# Altium schematic sheet mini-inverter.SchDoc
size A4; SheetNumber: 1; SheetTotal: 5
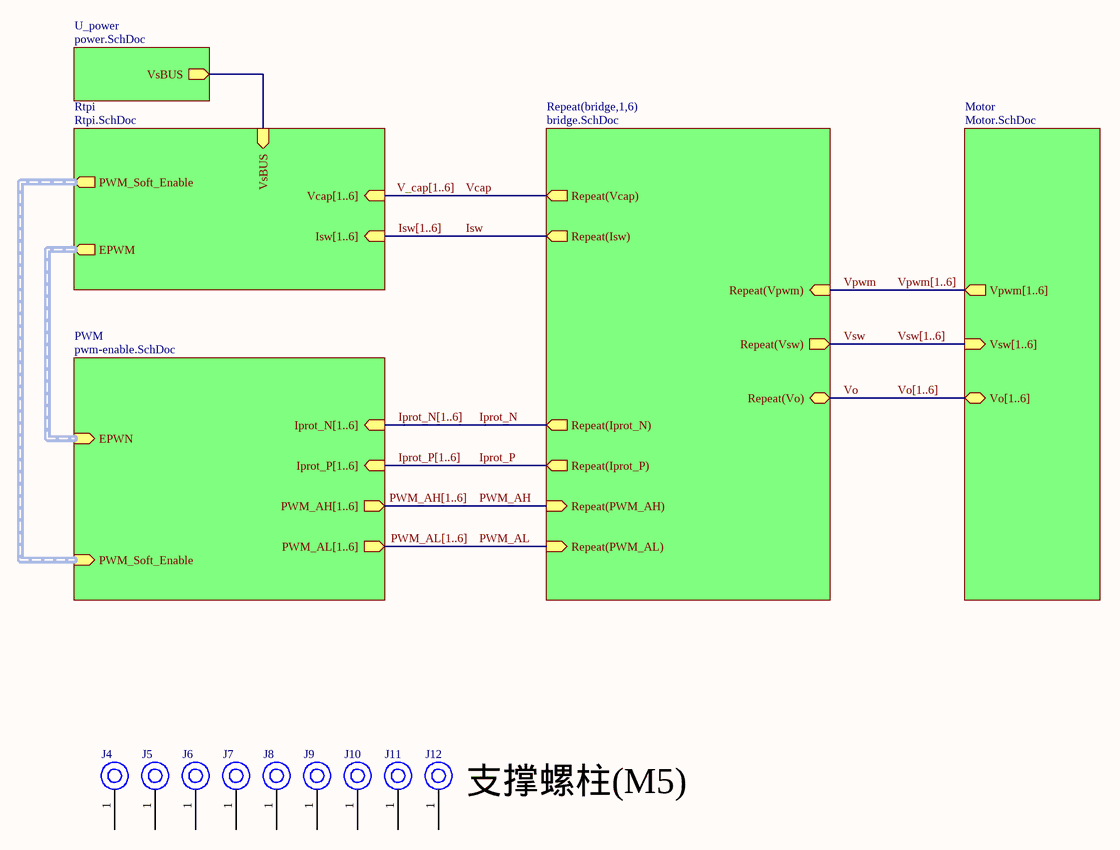
[diagram p0: mini-inverter.SchDoc]

## Parts
J4  M5 Mounting Hole  [M5 Mounting Hole]  (value not drawn)
J5  M5 Mounting Hole  [M5 Mounting Hole]  (value not drawn)
J6  M5 Mounting Hole  [M5 Mounting Hole]  (value not drawn)
J7  M5 Mounting Hole  [M5 Mounting Hole]  (value not drawn)
J8  M5 Mounting Hole  [M5 Mounting Hole]  (value not drawn)
J9  M5 Mounting Hole  [M5 Mounting Hole]  (value not drawn)
J10  M5 Mounting Hole  [M5 Mounting Hole]  (value not drawn)
J11  M5 Mounting Hole  [M5 Mounting Hole]  (value not drawn)
J12  M5 Mounting Hole  [M5 Mounting Hole]  (value not drawn)

## Sub-sheets
Motor = Motor.SchDoc: Vsw[1..6] (in), Vpwm[1..6] (out), Vo[1..6] (bidir)
PWM = pwm-enable.SchDoc: EPWN (in, harness EPWM), PWM_Soft_Enable (in, harness PWM_EN), PWM_AH[1..6] (out), Iprot_P[1..6] (in), Iprot_N[1..6] (in), PWM_AL[1..6] (out)
Repeat(bridge,1,6) = bridge.SchDoc: Repeat(PWM_AH) (in), Repeat(PWM_AL) (in), Repeat(Iprot_P) (out), Repeat(Iprot_N) (out), Repeat(Vsw) (out), Repeat(Vpwm) (in), Repeat(Isw) (out), Repeat(Vcap) (out), Repeat(Vo) (bidir)
Rtpi = Rtpi.SchDoc: EPWM (out, harness EPWM), PWM_Soft_Enable (out, harness PWM_EN), Vcap[1..6] (in), Isw[1..6] (in), VsBUS (in)
U_power = power.SchDoc: VsBUS (out)

## Nets
Iprot_N: sheet Repeat(bridge,1,6)/Repeat(Iprot_N)
Iprot_P: sheet Repeat(bridge,1,6)/Repeat(Iprot_P)
Isw: sheet Repeat(bridge,1,6)/Repeat(Isw)
PWM_AH: sheet Repeat(bridge,1,6)/Repeat(PWM_AH)
PWM_AL: sheet Repeat(bridge,1,6)/Repeat(PWM_AL)
Vcap: sheet Repeat(bridge,1,6)/Repeat(Vcap)
Vo: sheet Repeat(bridge,1,6)/Repeat(Vo)
Vpwm: sheet Repeat(bridge,1,6)/Repeat(Vpwm)
Vsw: sheet Repeat(bridge,1,6)/Repeat(Vsw)
(unnamed): sheet U_power/VsBUS, sheet Rtpi/VsBUS

Not connected (* = marked no-connect by the designer): J4 1; J5 1; J6 1; J7 1; J8 1; J9 1; J10 1; J11 1; J12 1

## Buses and harness runs
bus Iprot_N[1..6] = sheet PWM/Iprot_N[1..6]
bus Iprot_P[1..6] = sheet PWM/Iprot_P[1..6]
bus Isw[1..6] = sheet Rtpi/Isw[1..6]
bus PWM_AH[1..6] = sheet PWM/PWM_AH[1..6]
bus PWM_AL[1..6] = sheet PWM/PWM_AL[1..6]
bus V_cap[1..6] = sheet Rtpi/Vcap[1..6]
bus Vo[1..6] = sheet Motor/Vo[1..6]
bus Vpwm[1..6] = sheet Motor/Vpwm[1..6]
bus Vsw[1..6] = sheet Motor/Vsw[1..6]
harness sheet PWM/EPWN = sheet Rtpi/EPWM
harness sheet PWM/PWM_Soft_Enable = sheet Rtpi/PWM_Soft_Enable

## Notes on the sheet
- (near J12) 支撑螺柱(M5)